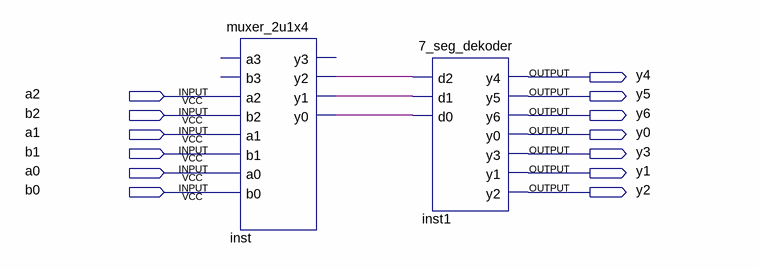
[diagram p0: schematic sheet]
// Quartus schematic selekcija_i_prikaz_karaktera.bdf as structural Verilog: 2 symbols, 13 pins
module selekcija_i_prikaz_karaktera (
  input  a2,
  input  b2,
  input  a1,
  input  b1,
  input  a0,
  input  b0,
  output y4,
  output y5,
  output y6,
  output y0,
  output y3,
  output y1,
  output y2
);

  wire inst_y0, inst_y1, inst_y2;

  muxer_2u1x4 inst (
    .a2(a2), .b2(b2), .a1(a1), .b1(b1), .a0(a0), .b0(b0), .y2(inst_y2), .y1(inst_y1), .y0(inst_y0));  // open: a3, b3, y3
  \7_seg_dekoder  inst1 (
    .d2(inst_y2), .d1(inst_y1), .d0(inst_y0), .y4(y4), .y5(y5), .y6(y6), .y0(y0), .y3(y3), .y1(y1), .y2(y2));
endmodule
